# Altium schematic sheet optoControl.SchDoc
size A4
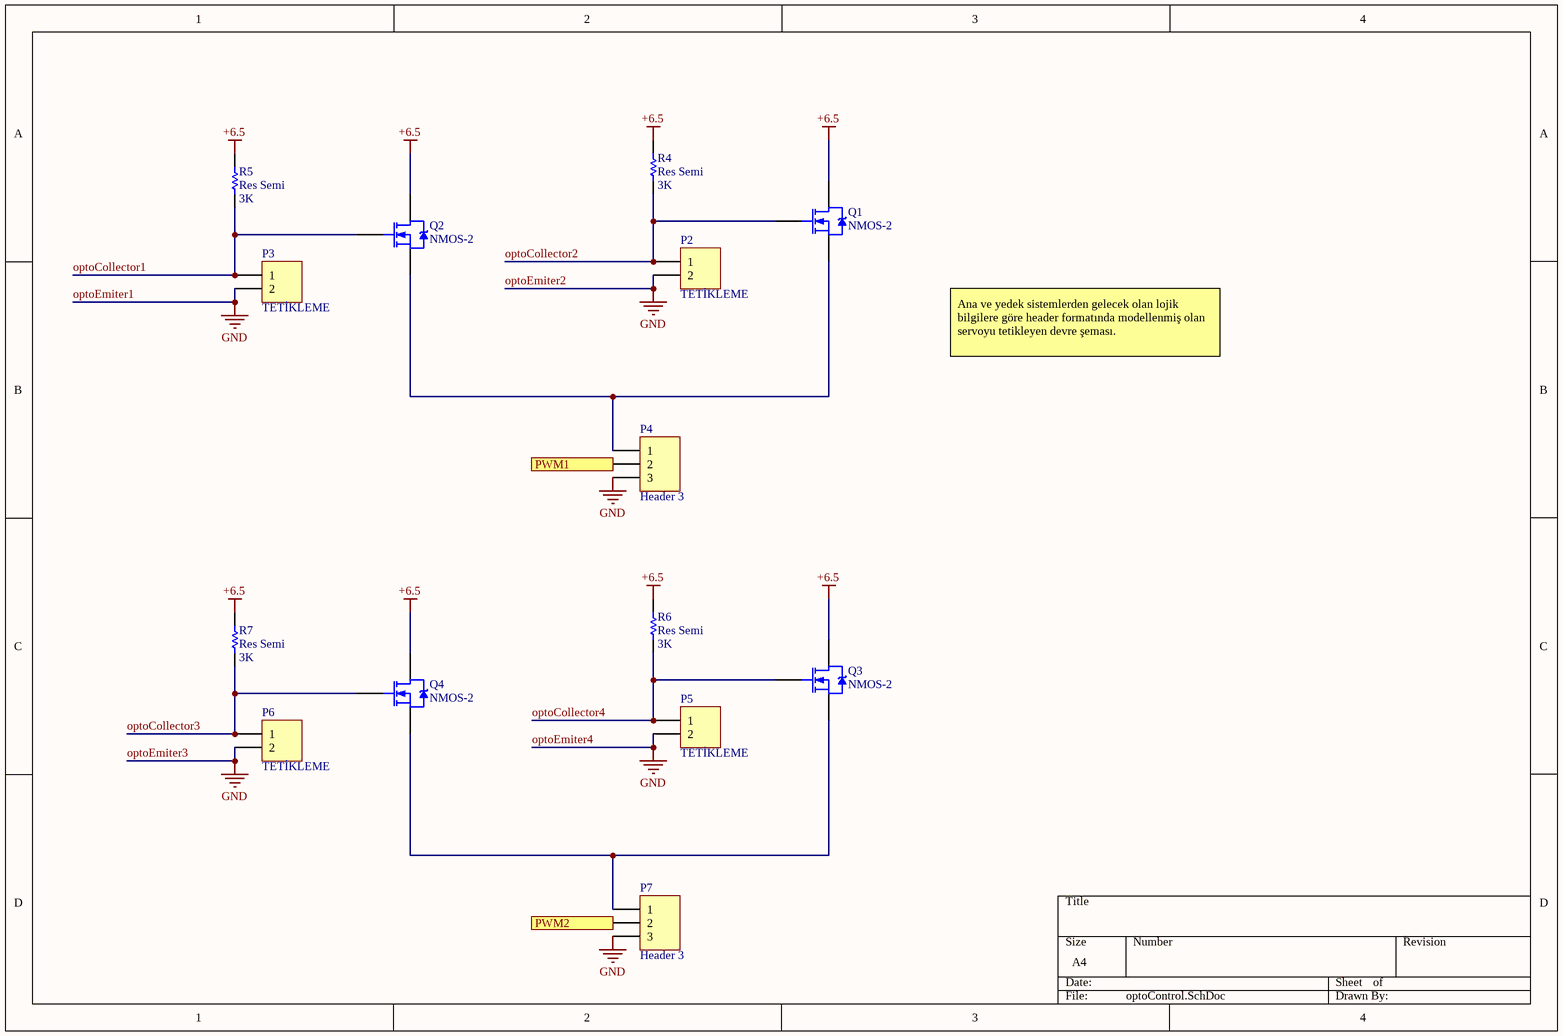
[diagram p0: optoControl.SchDoc]

## Parts
P2  TETİKLEME  [HDR1X2]
P3  TETİKLEME  [HDR1X2]
P4  Header 3  [HDR1X3]
P5  TETİKLEME  [HDR1X2]
P6  TETİKLEME  [HDR1X2]
P7  Header 3  [HDR1X3]
Q1  NMOS-2  [TO-220AB]
Q2  NMOS-2  [TO-220AB]
Q3  NMOS-2  [TO-220AB]
Q4  NMOS-2  [TO-220AB]
R4  Res Semi  value 3K  [AXIAL-0.5]
R5  Res Semi  value 3K  [AXIAL-0.5]
R6  Res Semi  value 3K  [AXIAL-0.5]
R7  Res Semi  value 3K  [AXIAL-0.5]

## Ports
PWM1 (in), PWM2 (in)

## Nets
+6.5: Q1.2(D) Q2.2(D) Q3.2(D) Q4.2(D) R4.2 R5.2 R6.2 R7.2
optoEmiter1: P2.2 P3.2 P4.3 P5.2 P6.2 P7.3  [also labelled GND, optoEmiter2, optoEmiter3, optoEmiter4]
optoCollector1: P3.1 Q2.1(G) R5.1
optoCollector2: P2.1 Q1.1(G) R4.1
optoCollector3: P6.1 Q4.1(G) R7.1
optoCollector4: P5.1 Q3.1(G) R6.1
PWM1: P4.2 ; port PWM1
PWM2: P7.2 ; port PWM2
NetP4_1: P4.1 Q1.3(S) Q2.3(S)
NetP7_1: P7.1 Q3.3(S) Q4.3(S)

## Notes on the sheet
- Ana ve yedek sistemlerden gelecek olan lojik bilgilere göre header formatında modellenmiş olan servoyu tetikleyen devre şeması.

## Library data of the parts
P2 P3 P5 P6 = Header 2: Header, 2-Pin; LatestRevisionDate: 17-Jul-2002; LatestRevisionNote: Re-released for DXP Platform.; Publisher: Altium Limited
P4 P7 = Header 3: Header, 3-Pin; LatestRevisionDate: 17-Jul-2002; LatestRevisionNote: Re-released for DXP Platform.; Publisher: Altium Limited
Q1-Q4 = NMOS-2: N-Channel Power MOSFET; Note: Pin 2 is electrically connected to pin 4.; Published: 8-Jun-2000; LatestRevisionDate: 17-Jul-2002; LatestRevisionNote: Re-released for DXP Platform.; DatasheetVersion: PD-9.814; PackageVersion: Feb-1997; PackageReference: TO-220AB; Publisher: Altium Limited; PackageDescription: TO, Thru-Hole, Vertical, Heatsink Mounted; 3 In-Line Leads; Pitch 2.54 mm; ComponentLink1Description: Manufacturer Link; ComponentLink1URL: http://www.irf.com/
R4-R7 = Res Semi: Semiconductor Resistor; Published: 8-Jun-2000; LatestRevisionDate: 17-Jul-2002; LatestRevisionNote: Re-released for DXP Platform.; PackageReference: AXIAL-0.5; Publisher: Altium Limited; PackageDescription: Axial Device, Thru-Hole; 2 Leads; 0.5 in Pin Spacing